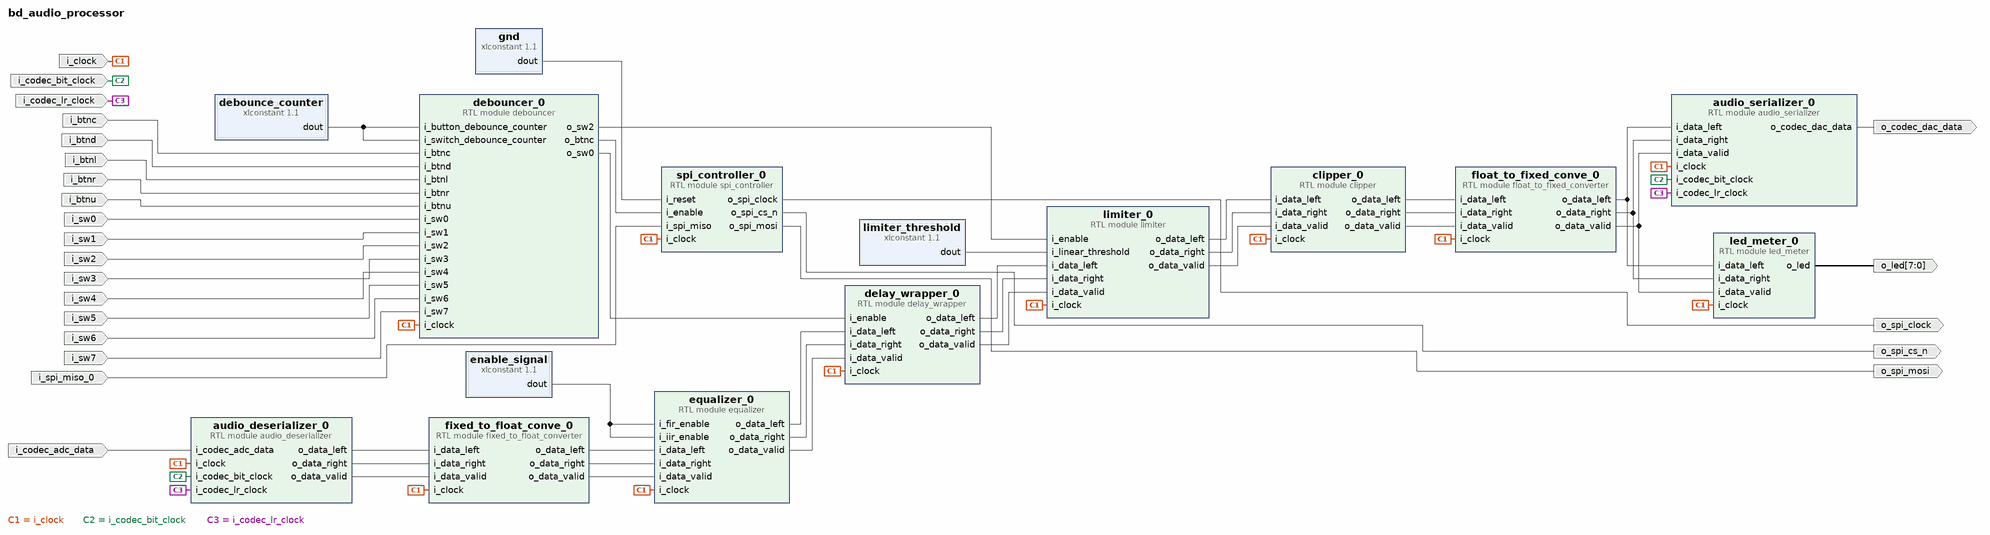
[diagram p0: block diagram of the top level]
# Vivado block design bd_audio_processor, xc7z010clg400-1, Vivado 2023.2
create_bd_design bd_audio_processor

create_bd_port -dir I -type clk i_clock
create_bd_port -dir I -type clk i_codec_bit_clock
create_bd_port -dir I -type clk i_codec_lr_clock
create_bd_port -dir I i_codec_adc_data
create_bd_port -dir I i_sw0
create_bd_port -dir I i_sw1
create_bd_port -dir I i_sw2
create_bd_port -dir I i_sw3
create_bd_port -dir I i_sw4
create_bd_port -dir I i_sw5
create_bd_port -dir I i_sw6
create_bd_port -dir I i_sw7
create_bd_port -dir I i_btnu
create_bd_port -dir I i_btnd
create_bd_port -dir I i_btnl
create_bd_port -dir I i_btnr
create_bd_port -dir I i_btnc
create_bd_port -dir O o_codec_dac_data
create_bd_port -dir O -from 7 -to 0 o_led
create_bd_port -dir I i_spi_miso_0
create_bd_port -dir O -type clk o_spi_clock
create_bd_port -dir O o_spi_cs_n
create_bd_port -dir O o_spi_mosi

create_bd_cell -type module -reference audio_deserializer audio_deserializer_0
create_bd_cell -type module -reference debouncer debouncer_0
create_bd_cell -type ip -vlnv xilinx.com:ip:xlconstant:1.1 debounce_counter
set_property -dict {CONFIG.CONST_VAL 65535 CONFIG.CONST_WIDTH 16} [get_bd_cells debounce_counter]
create_bd_cell -type module -reference fixed_to_float_converter fixed_to_float_conve_0
create_bd_cell -type module -reference equalizer equalizer_0
create_bd_cell -type ip -vlnv xilinx.com:ip:xlconstant:1.1 enable_signal
create_bd_cell -type module -reference delay_wrapper delay_wrapper_0
create_bd_cell -type module -reference limiter limiter_0
create_bd_cell -type ip -vlnv xilinx.com:ip:xlconstant:1.1 limiter_threshold
set_property -dict {CONFIG.CONST_VAL 4194032 CONFIG.CONST_WIDTH 32} [get_bd_cells limiter_threshold]
create_bd_cell -type module -reference clipper clipper_0
create_bd_cell -type module -reference float_to_fixed_converter float_to_fixed_conve_0
create_bd_cell -type module -reference audio_serializer audio_serializer_0
create_bd_cell -type module -reference led_meter led_meter_0
create_bd_cell -type module -reference spi_controller spi_controller_0
create_bd_cell -type ip -vlnv xilinx.com:ip:xlconstant:1.1 gnd
set_property -dict {CONFIG.CONST_VAL 0} [get_bd_cells gnd]

# ---- connections ----

connect_bd_net [get_bd_pins audio_deserializer_0/o_data_left] [get_bd_pins fixed_to_float_conve_0/i_data_left]
connect_bd_net [get_bd_pins audio_deserializer_0/o_data_right] [get_bd_pins fixed_to_float_conve_0/i_data_right]
connect_bd_net [get_bd_pins audio_deserializer_0/o_data_valid] [get_bd_pins fixed_to_float_conve_0/i_data_valid]
connect_bd_net [get_bd_pins audio_serializer_0/o_codec_dac_data] [get_bd_ports o_codec_dac_data]
connect_bd_net [get_bd_pins clipper_0/o_data_left] [get_bd_pins float_to_fixed_conve_0/i_data_left]
connect_bd_net [get_bd_pins clipper_0/o_data_right] [get_bd_pins float_to_fixed_conve_0/i_data_right]
connect_bd_net [get_bd_pins clipper_0/o_data_valid] [get_bd_pins float_to_fixed_conve_0/i_data_valid]
connect_bd_net [get_bd_pins debounce_counter/dout] \
  [get_bd_pins debouncer_0/i_switch_debounce_counter] [get_bd_pins debouncer_0/i_button_debounce_counter]
connect_bd_net [get_bd_pins debouncer_0/o_btnc] [get_bd_pins spi_controller_0/i_enable]
connect_bd_net [get_bd_pins debouncer_0/o_sw0] [get_bd_pins delay_wrapper_0/i_enable]
connect_bd_net [get_bd_pins debouncer_0/o_sw2] [get_bd_pins limiter_0/i_enable]
connect_bd_net [get_bd_pins delay_wrapper_0/o_data_left] [get_bd_pins limiter_0/i_data_left]
connect_bd_net [get_bd_pins delay_wrapper_0/o_data_right] [get_bd_pins limiter_0/i_data_right]
connect_bd_net [get_bd_pins delay_wrapper_0/o_data_valid] [get_bd_pins limiter_0/i_data_valid]
connect_bd_net [get_bd_pins enable_signal/dout] [get_bd_pins equalizer_0/i_fir_enable] [get_bd_pins equalizer_0/i_iir_enable]
connect_bd_net [get_bd_pins equalizer_0/o_data_left] [get_bd_pins delay_wrapper_0/i_data_left]
connect_bd_net [get_bd_pins equalizer_0/o_data_right] [get_bd_pins delay_wrapper_0/i_data_right]
connect_bd_net [get_bd_pins equalizer_0/o_data_valid] [get_bd_pins delay_wrapper_0/i_data_valid]
connect_bd_net [get_bd_pins fixed_to_float_conve_0/o_data_left] [get_bd_pins equalizer_0/i_data_left]
connect_bd_net [get_bd_pins fixed_to_float_conve_0/o_data_right] [get_bd_pins equalizer_0/i_data_right]
connect_bd_net [get_bd_pins fixed_to_float_conve_0/o_data_valid] [get_bd_pins equalizer_0/i_data_valid]
connect_bd_net [get_bd_pins float_to_fixed_conve_0/o_data_left] [get_bd_pins audio_serializer_0/i_data_left] [get_bd_pins led_meter_0/i_data_left]
connect_bd_net [get_bd_pins float_to_fixed_conve_0/o_data_right] [get_bd_pins audio_serializer_0/i_data_right] [get_bd_pins led_meter_0/i_data_right]
connect_bd_net [get_bd_pins float_to_fixed_conve_0/o_data_valid] [get_bd_pins audio_serializer_0/i_data_valid] [get_bd_pins led_meter_0/i_data_valid]
connect_bd_net [get_bd_pins gnd/dout] [get_bd_pins spi_controller_0/i_reset]
connect_bd_net -net i_btnc_0_1 [get_bd_ports i_btnc] [get_bd_pins debouncer_0/i_btnc]
connect_bd_net -net i_btnd_0_1 [get_bd_ports i_btnd] [get_bd_pins debouncer_0/i_btnd]
connect_bd_net -net i_btnl_0_1 [get_bd_ports i_btnl] [get_bd_pins debouncer_0/i_btnl]
connect_bd_net -net i_btnr_0_1 [get_bd_ports i_btnr] [get_bd_pins debouncer_0/i_btnr]
connect_bd_net -net i_btnu_0_1 [get_bd_ports i_btnu] [get_bd_pins debouncer_0/i_btnu]
connect_bd_net -net i_clock_0_1 [get_bd_ports i_clock] \
  [get_bd_pins audio_deserializer_0/i_clock] [get_bd_pins debouncer_0/i_clock] [get_bd_pins fixed_to_float_conve_0/i_clock] \
  [get_bd_pins equalizer_0/i_clock] [get_bd_pins delay_wrapper_0/i_clock] [get_bd_pins limiter_0/i_clock] \
  [get_bd_pins clipper_0/i_clock] [get_bd_pins float_to_fixed_conve_0/i_clock] [get_bd_pins audio_serializer_0/i_clock] \
  [get_bd_pins led_meter_0/i_clock] [get_bd_pins spi_controller_0/i_clock]
connect_bd_net -net i_codec_adc_data_0_1 [get_bd_ports i_codec_adc_data] [get_bd_pins audio_deserializer_0/i_codec_adc_data]
connect_bd_net -net i_codec_bit_clock_0_1 [get_bd_ports i_codec_bit_clock] \
  [get_bd_pins audio_deserializer_0/i_codec_bit_clock] [get_bd_pins audio_serializer_0/i_codec_bit_clock]
connect_bd_net -net i_codec_lr_clock_0_1 [get_bd_ports i_codec_lr_clock] \
  [get_bd_pins audio_deserializer_0/i_codec_lr_clock] [get_bd_pins audio_serializer_0/i_codec_lr_clock]
connect_bd_net -net i_spi_miso_0_1 [get_bd_ports i_spi_miso_0] [get_bd_pins spi_controller_0/i_spi_miso]
connect_bd_net -net i_sw0_0_1 [get_bd_ports i_sw0] [get_bd_pins debouncer_0/i_sw0]
connect_bd_net -net i_sw1_0_1 [get_bd_ports i_sw1] [get_bd_pins debouncer_0/i_sw1]
connect_bd_net -net i_sw2_0_1 [get_bd_ports i_sw2] [get_bd_pins debouncer_0/i_sw2]
connect_bd_net -net i_sw3_0_1 [get_bd_ports i_sw3] [get_bd_pins debouncer_0/i_sw3]
connect_bd_net -net i_sw4_0_1 [get_bd_ports i_sw4] [get_bd_pins debouncer_0/i_sw4]
connect_bd_net -net i_sw5_0_1 [get_bd_ports i_sw5] [get_bd_pins debouncer_0/i_sw5]
connect_bd_net -net i_sw6_0_1 [get_bd_ports i_sw6] [get_bd_pins debouncer_0/i_sw6]
connect_bd_net -net i_sw7_0_1 [get_bd_ports i_sw7] [get_bd_pins debouncer_0/i_sw7]
connect_bd_net [get_bd_pins led_meter_0/o_led] [get_bd_ports o_led]
connect_bd_net [get_bd_pins limiter_0/o_data_left] [get_bd_pins clipper_0/i_data_left]
connect_bd_net [get_bd_pins limiter_0/o_data_right] [get_bd_pins clipper_0/i_data_right]
connect_bd_net [get_bd_pins limiter_0/o_data_valid] [get_bd_pins clipper_0/i_data_valid]
connect_bd_net [get_bd_pins limiter_threshold/dout] [get_bd_pins limiter_0/i_linear_threshold]
connect_bd_net [get_bd_pins spi_controller_0/o_spi_clock] [get_bd_ports o_spi_clock]
connect_bd_net [get_bd_pins spi_controller_0/o_spi_cs_n] [get_bd_ports o_spi_cs_n]
connect_bd_net [get_bd_pins spi_controller_0/o_spi_mosi] [get_bd_ports o_spi_mosi]

validate_bd_design
save_bd_design
